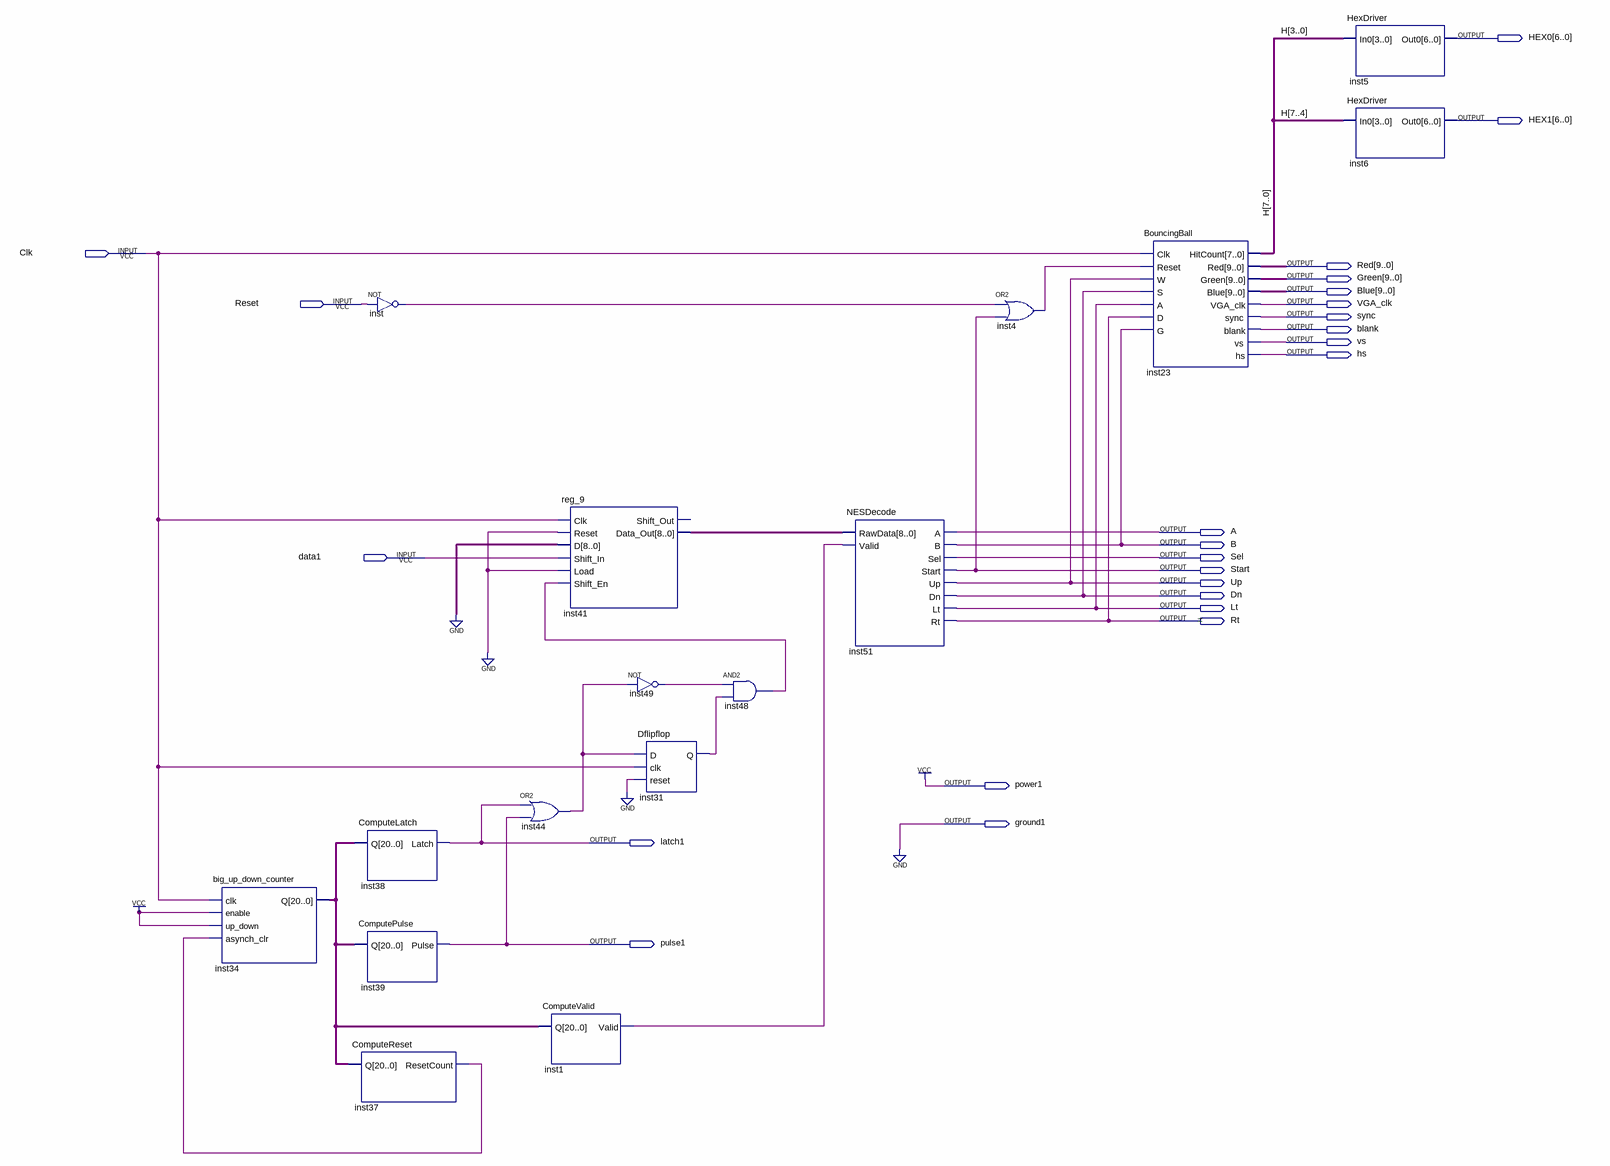
[diagram p0: schematic sheet]
// Quartus schematic final.bdf as structural Verilog: 16 symbols, 25 pins
module \final  (
  input  Clk,
  input  Reset,
  input  data1,
  output [6:0] HEX0,
  output [6:0] HEX1,
  output [9:0] Red,
  output [9:0] Green,
  output [9:0] Blue,
  output VGA_clk,
  output sync,
  output blank,
  output vs,
  output hs,
  output A,
  output B,
  output Sel,
  output Start,
  output Up,
  output Dn,
  output Lt,
  output Rt,
  output power1,
  output ground1,
  output latch1,
  output pulse1
);

  wire inst1_valid, inst4_out, inst31_q, inst37_resetcount, inst44_out, inst48_out, inst49_out, inst_out;
  wire [7:0] H;
  wire [8:0] inst41_data_out;
  wire [20:0] inst34_q;

  big_up_down_counter inst34 (.clk(Clk), .enable(1'b1), .up_down(1'b1), .asynch_clr(inst37_resetcount), .Q(inst34_q));
  ComputeReset inst37 (.Q(inst34_q), .ResetCount(inst37_resetcount));
  not inst (inst_out, Reset);
  ComputeLatch inst38 (.Q(inst34_q), .Latch(latch1));
  ComputePulse inst39 (.Q(inst34_q), .Pulse(pulse1));
  or inst44 (inst44_out, latch1, pulse1);
  ComputeValid inst1 (.Q(inst34_q), .Valid(inst1_valid));
  reg_9 inst41 (
    .Clk(Clk), .Reset(1'b0), .D({9{1'b0}}), .Shift_In(data1), .Load(1'b0), .Shift_En(inst48_out),
    .Data_Out(inst41_data_out));  // open: Shift_Out
  not inst49 (inst49_out, inst44_out);
  Dflipflop inst31 (.D(inst44_out), .clk(Clk), .reset(1'b0), .Q(inst31_q));
  and inst48 (inst48_out, inst49_out, inst31_q);
  NESDecode inst51 (
    .RawData(inst41_data_out), .Valid(inst1_valid), .A(A), .B(B), .Sel(Sel), .Start(Start), .Up(Up), .Dn(Dn),
    .Lt(Lt), .Rt(Rt));
  or inst4 (inst4_out, inst_out, Start);
  BouncingBall inst23 (
    .Clk(Clk), .Reset(inst4_out), .W(Up), .S(Dn), .A(Lt), .D(Rt), .G(B), .HitCount(H), .Red(Red),
    .Green(Green), .Blue(Blue), .VGA_clk(VGA_clk), .sync(sync), .blank(blank), .vs(vs), .hs(hs));
  HexDriver inst5 (.In0(H[3:0]), .Out0(HEX0));
  HexDriver inst6 (.In0(H[7:4]), .Out0(HEX1));

  assign ground1 = 1'b0;
  assign power1 = 1'b1;

  // Notes on the sheet:
  //   =
endmodule
